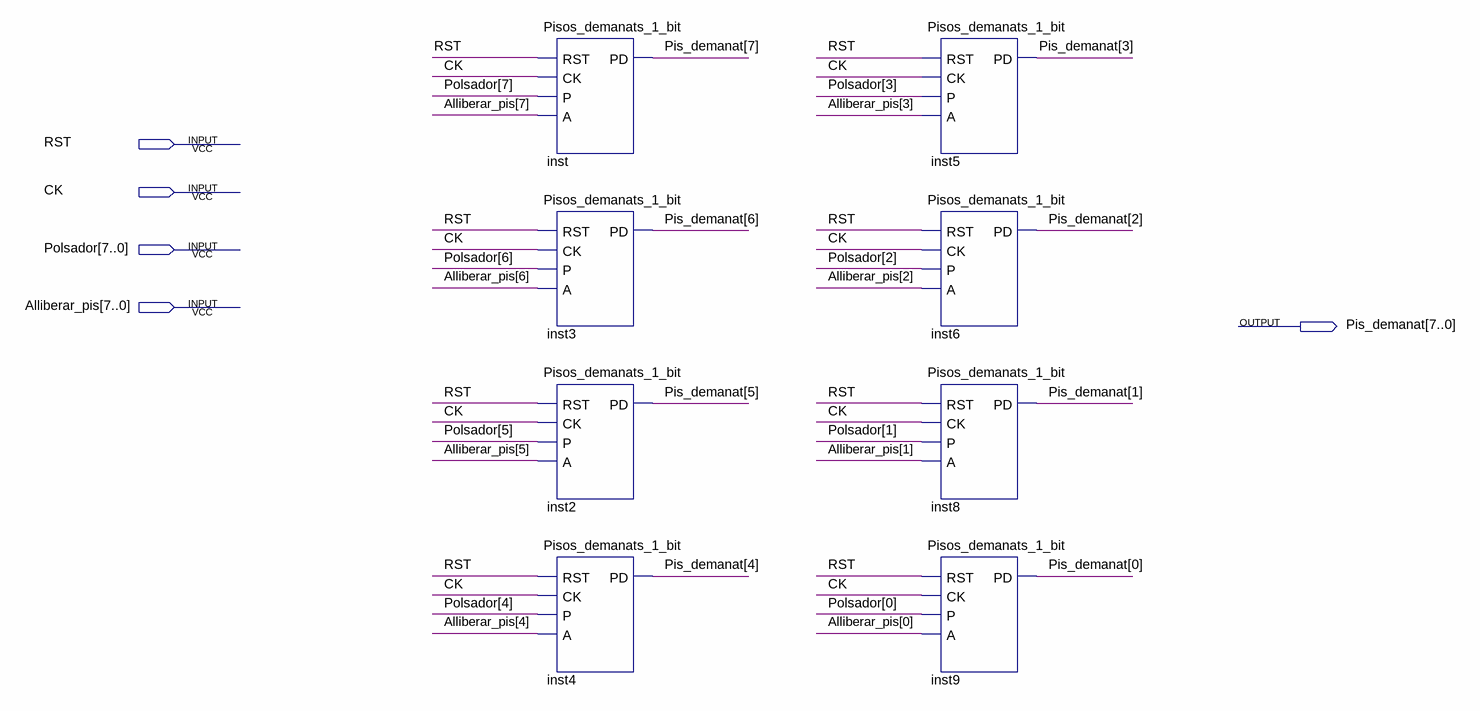
[diagram p0: schematic sheet]
// Quartus schematic Pisos_demanats.bdf as structural Verilog: 8 symbols, 5 pins
module Pisos_demanats (
  input  RST,
  input  CK,
  input  [7:0] Polsador,
  input  [7:0] Alliberar_pis,
  output [7:0] Pis_demanat
);

  Pisos_demanats_1_bit inst (.RST(RST), .CK(CK), .P(Polsador[7]), .A(Alliberar_pis[7]), .PD(Pis_demanat[7]));
  Pisos_demanats_1_bit inst3 (.RST(RST), .CK(CK), .P(Polsador[6]), .A(Alliberar_pis[6]), .PD(Pis_demanat[6]));
  Pisos_demanats_1_bit inst2 (.RST(RST), .CK(CK), .P(Polsador[5]), .A(Alliberar_pis[5]), .PD(Pis_demanat[5]));
  Pisos_demanats_1_bit inst4 (.RST(RST), .CK(CK), .P(Polsador[4]), .A(Alliberar_pis[4]), .PD(Pis_demanat[4]));
  Pisos_demanats_1_bit inst5 (.RST(RST), .CK(CK), .P(Polsador[3]), .A(Alliberar_pis[3]), .PD(Pis_demanat[3]));
  Pisos_demanats_1_bit inst6 (.RST(RST), .CK(CK), .P(Polsador[2]), .A(Alliberar_pis[2]), .PD(Pis_demanat[2]));
  Pisos_demanats_1_bit inst8 (.RST(RST), .CK(CK), .P(Polsador[1]), .A(Alliberar_pis[1]), .PD(Pis_demanat[1]));
  Pisos_demanats_1_bit inst9 (.RST(RST), .CK(CK), .P(Polsador[0]), .A(Alliberar_pis[0]), .PD(Pis_demanat[0]));
endmodule
